# Altium schematic sheet MCU IO.SchDoc: MCU
size A4; Date: 30 08 2013; Author: Rachid AKKOUCHE; CompanyName: MDI; DrawnBy: Rachid AKKOUCHE; Engineer: Rachid AKKOUCHE; Organization: RASoftware; Address1: 52 J03, rue de la crèche; Address3: 77100 MEAUX; Address4: FRANCE; DocumentNumber: BRA2013090103C2; Revision: C; SheetNumber: 2; SheetTotal: 4; Telephone: +33651604047; Email: rachid.akkouche@wanadoo.fr; Dessinepar: -; Verifiepar: -; Property: RASoftware; Time: 13:00; ProjectName: IO BOARD CERES-V3; Application_BuildNumber: 01
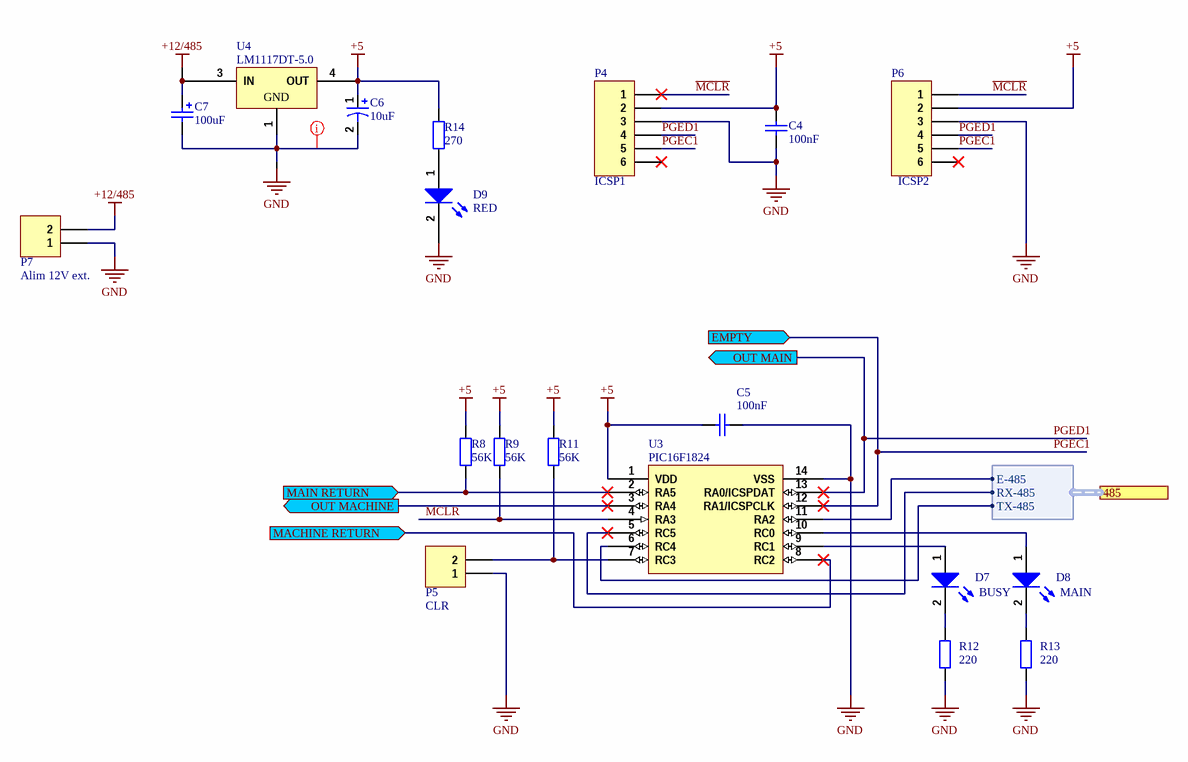
[diagram p0: MCU IO.SchDoc]

## Parts
C4  100nF  [C0805]
C5  100nF  [C0805]
C6  10uF  [KEMET_4]
C7  100uF  [Kemet_63]
D7  Indicator: BUSY  [0603-LEDR]  (hidden comment: HSMH-C190)
D8  Indicator: MAIN  [0603-LEDV]  (hidden comment: HSMH-C190)
D9  Couleur: RED  [0603-LEDR]  (hidden comment: HSMH-C190)
P4  ICSP1  [TC2030]  (no BOM)
P5  CLR  [M20_1X2]
P6  ICSP2  [6SIP100]  (no BOM)
P7  Alim 12V ext.  [CO2P508]  (no BOM)
R8  56K  [R0805]
R9  56K  [R0805]
R11  56K  [R0805]
R12  220  [R0805]
R13  220  [R0805]
R14  270  [R0805]
U3  PIC16F1824  [so-14]
U4  LM1117DT-5.0  [SOT223]

## Ports
485 (harness EIA-485), EMPTY (in), MACHINE RETURN (in), MAIN RETURN (in), OUT MACHINE (out), OUT MAIN (out)

## Harnesses
EIA-485: TX-485, RX-485, E-485

## Nets
+5: C4.2 C5.2 C6.1 P4.2 P6.2 R8.2 R9.2 R11.2 R14.2 U3.1(VDD) U4.4(OUT)
+12/485: C7.1 P7.2 U4.3(IN)
GND: C4.1 C5.1 C6.2 C7.2 D9.2(K) P4.3 P5.1 P6.3 P7.1 R12.1 R13.1 U3.14(VSS) U4.1(GND)
~{MCLR}: P4.1 P6.1 R9.1 U3.4(RA3)
MACHINE RETURN: U3.8(RC2) ; port MACHINE RETURN
MAIN RETURN: R8.1 U3.2(RA5) ; port MAIN RETURN
OUT MACHINE: U3.3(RA4) ; port OUT MACHINE
PGEC1: P4.5 P6.5 U3.12(RA1/ICSPCLK) ; port EMPTY
PGED1: P4.4 P6.4 U3.13(RA0/ICSPDAT) ; port OUT MAIN
NetD7_1: D7.1(A) U3.9(RC1)
NetD7_2: D7.2(K) R12.2
NetD8_1: D8.1(A) U3.10(RC0)
NetD8_2: D8.2(K) R13.2
NetD9_1: D9.1(A) R14.1
NetP5_2: P5.2 R11.1 U3.7(RC3)
NetU3_5: U3.5(RC5) ; port 485.RX-485
NetU3_6: U3.6(RC4) ; port 485.TX-485
NetU3_11: U3.11(RA2) ; port 485.E-485

Not connected (* = marked no-connect by the designer): P4 6*; P6 6*

## Layout directives
rule Width Constraint [Pref Width = 0.55mm    Min Width = 0.254mm    Max Width = 2mm]: GND

## Notes on the sheet
- Ce document est la propriété de
- Project:
- Il ne peut être divulgué sans l'accord écrit de l'un de ses représentants dûment mandaté
- Title:
- Number:
- Date:
- Time:
- Size:
- A4
- Revision:
- Sheet
- of
- 52 J03 rue de la crèche
- Draw by:
- 77100 Meaux

## Library data of the parts
C4 C5 = Cap 0805 100nF: Capacitor; Manufacturer: MULTICOMP; Manufacturer Part Number: MCCA000296; Supplier 1: Farnell; Supplier Part Number 1: 1759167; Pricing 1: 100=0,01, 500=0,008, 1000=0,006, 4000=0,005 (EUR); ComponentLink1URL: http://www.farnell.com/datasheets/1520827.pdf; ComponentLink1Description: http://www.farnell.com/datasheets/1520827.pdf
C6 = Cap Pol1: Polarized Capacitor; Manufacturer: KEMET; Manufacturer Part Number: EXV106M025A9BAA; Supplier 1: Farnell; Supplier Part Number 1: 2069174; RoHS: YES; Pricing 1: 10=0,111, 100=0,085, 500=0,074, 1000=0,07, 5000=0,066 (EUR); ComponentLink1URL: http://www.farnell.com/datasheets/1500293.pdf; ComponentLink1Description: http://www.farnell.com/datasheets/1500293.pdf
C7 = Cap Pol 100uF: Polarized Capacitor; Manufacturer: EPCOS; Manufacturer Part Number: B41142A4107M; Product Range: EPCOS - B41142 Series; Capacité: 100; Tolérance de capacité: ± 20%; Tension: 16; Type de boîtier de condensateur: Radial Can - SMD; Diamètre: 6.3; Résistance, ESR: 0.16; Hauteur: 7.7; Courant d'ondulation c.a.: 300; Type de packaging: Cut Tape; Durée de vie @ température: 2000 heures @ 105; Température d'utilisation min: -55; Température de fonctionnement max..: 105; SVHC: No SVHC (19-Dec-2012); Impédance: 0.26; Température de fonctionnement: -55°C à +105; Température, ESR: 20; Type de boîtier: CMS; Supplier 1: Farnell; RoHS: YES; Pricing 1: 10=0,123, 50=0,095, 100=0,078, 250=0,07, 1000=0,062 (EUR); Courant d'ondulation c.a. à  100Hz: 300; Fréquence, impédance: 100; Longueur/hauteur: 7.7; Température, courant ondulatoire: 105; Température, impédance: 20; ComponentLink1URL: http://www.epcos.com/inf/20/30/db/alu_x/B41142.pdf; ComponentLink1Description: http://www.epcos.com/inf/20/30/db/alu_x/B41142.pdf; Supplier Part Number 1: 1735328
D7-D9 = HSMH-C190: Surface Mount Chip LED, Red; Manufacturer: AVAGO TECHNOLOGIES; Manufacturer Part Number: HSMH-C190.; Taille de lampe: 0.8mm x 1; Couleur de LED: Rouge; Intensité lumineuse: 17; Angle, vision: 170°; Courant, direct, If: 20; Tension, direct à  If: 1.8; Montage LED: CMS; Forme de lentille: Rectangulaire; Longueur d'onde typ.: 626; SVHC: No SVHC (19-Dec-2012); Dissipation de puissance: 65; Intensité lumineuse min. à  If: 2.8; Intensité lumineuse typique: 10; Largeur (externe): 0.8; Longueur d'onde dominante: 639; Longueur d'onde, crête: 630; Longueur/hauteur: 1.6; Matière: AlGaAs; Nombre de broches: 2; Orientation de montage opto: Dessus; Orientation sortie de lumière: Top Emitting; Température de fonctionnement: -30°C à +85; Température de fonctionnement max..: 85; Température, stockage min.: -40; Température d'utilisation min: -30; Tension, Vf max..: 2.6; Tension, Vf min.: 2.1; Type de LED: Standard; Supplier 1: Farnell; Supplier Part Number 1: 8554641; RoHS: YES; Pricing 1: 5=0,06, 25=0,059, 100=0,057, 250=0,052, 500=0,047 (EUR); MSL: MSL 2A - 4 semaines; Couleur, LED: Rouge; Profondeur: 0.8; Température, stockage max..: 85; Tension, Vf typ.: 1.8; ComponentLink1URL: http://www.farnell.com/datasheets/313031.pdf; ComponentLink1Description: http://www.farnell.com/datasheets/313031.pdf; ComponentLink2URL: http://www.farnell.com/datasheets/55927.pdf; ComponentLink2Description: http://www.farnell.com/datasheets/55927.pdf
  D7 D8: Couleur: RED
  D9: Stock 1: 13902
P4 = Header 6: Header, 6-Pin; Manufacturer: HARWIN; Manufacturer Part Number: M20-8770642; Type de connecteur: Contact fil-à-carte; Série: M20; Terminaison du contact: Montage en surface vertical; Genre: Embase; Nombre de contacts: 6; Nombre de rangées: 1; Pas: 2.54; Plaquage du contact: Or; Matériau du contact: Laiton; SVHC: No SVHC (19-Dec-2012); Supplier 1: Farnell; Supplier Part Number 1: 1517384; RoHS: YES; Stock 1: 3471; Pricing 1: 10=0,69, 20=0,66, 50=0,62, 100=0,6, 250=0,56, 500=0,49 (EUR); Pas, rang: 2.54; ComponentLink1URL: http://www.farnell.com/datasheets/1089524.pdf; ComponentLink1Description: http://www.farnell.com/datasheets/1089524.pdf; ComponentLink2URL: http://www.farnell.com/datasheets/5481.pdf; ComponentLink2Description: http://www.farnell.com/datasheets/5481.pdf
P5 = Header 2: Header, 2-Pin; Manufacturer: HARWIN; Manufacturer Part Number: M20-8770242; LatestRevisionDate: 17-Jul-2002; LatestRevisionNote: Re-released for DXP Platform.; Publisher: Altium Limited; Supplier 1: Farnell; Supplier Part Number 1: 1895211; RoHS: YES; Pricing 1: 10=0,137, 20=0,136, 50=0,135, 100=0,133, 250=0,128, 500=0,12 (EUR); ComponentLink1URL: http://www.farnell.com/cad/1330190.pdf; ComponentLink1Description: http://www.farnell.com/cad/1330190.pdf
P6 = Header 6: Header, 6-Pin; Manufacturer: TE CONNECTIVITY / AMP; Manufacturer Part Number: 4-103321-8.; Série: AMPMODU; Pas: 2.54; Nombre de rangées: 1; Nombre de contacts: 40; Genre: Embase; Terminaison du contact: A souder; Plaquage du contact: Etain; Matériau du contact: Bronze phosphoreux; Courant: 3; Matériau isolant: Thermoplastique; Organismes d'agrément: CSA, UL; Résistance d'isolement: 500; Température de fonctionnement max..: 105; Température d'utilisation min: -65; Type de boitier: Plastique noir UL94V-0; Supplier 1: Farnell; Supplier Part Number 1: 1098454; RoHS: YES; Stock 1: 2602; Pricing 1: 1=2,12, 50=1,79, 100=1,34, 500=1,14, 1000=1,05 (EUR); Méthode de terminaison: A souder; ComponentLink1URL: http://www.tycoelectronics.com/commerce/DocumentDelivery/DDEController?Action=srchrtrv&DocNm=4-103321-8&DocType=Customer+View+Model&DocLang=English; ComponentLink1Description: http://www.tycoelectronics.com/commerce/DocumentDelivery/DDEController?Action=srchrtrv&DocNm=4-103321-8&DocType=Customer+View+Model&DocLang=English; ComponentLink2URL: http://www.farnell.com/datasheets/38278.pdf; ComponentLink2Description: http://www.farnell.com/datasheets/38278.pdf
P7 = Header 2: Header, 2-Pin
R8 R9 R11 = Resistor 0805 56K: Resistor; Manufacturer: MULTICOMP; Manufacturer Part Number: MC0.1W08051%56KFR; Product Range: MULTICOMP - MC Series; Résistance: 56; Puissance: 100; Tolérance de résistance: ± 1%; Type de boîtier de résistance: 0805; Type de résistance: Couche épaisse; Coefficient de température: ± 100; Tension: 150; Type de packaging: Full Reel; Resistor Mounting: CMS; Resistor Terminals: (Non Disponible); Supplier 1: Farnell; RoHS: YES; Pricing 1: 5000=0,001 (EUR); MSL: (Non Applicable); ComponentLink1URL: http://www.farnell.com/datasheets/1716700.pdf; ComponentLink1Description: http://www.farnell.com/datasheets/1716700.pdf; Supplier Part Number 1: 2129258
R12 R13 = Resistor 0805 220: Resistor; Manufacturer: MULTICOMP; Manufacturer Part Number: MC01W08051220R; Gamme de produit: MULTICOMP - MC Series; Puissance: 100; Tolérance de résistance: ± 1%; Type de boîtier de résistance: 0805; Type de résistance: Couche épaisse; Coefficient de température: ± 100; Tension: 150; Type de packaging: Bande et Bobine; SVHC: No SVHC (20-Jun-2013); Montage de résistance: CMS; Quantité par bobine: 5000; Supplier 1: Farnell; RoHS: YES; Stock 1: 199995; Pricing 1: 5000=0,001, 25000=0,0009, 50000=0,0008 (EUR); Résistance: 220; MSL: -; ComponentLink1URL: http://www.farnell.com/datasheets/1729047.pdf; ComponentLink1Description: http://www.farnell.com/datasheets/1729047.pdf; Supplier Part Number 1: 2129060
R14 = Resistor 0805 1K: Resistor; Manufacturer: MULTICOMP; Manufacturer Part Number: MC0.1W08051%1KFR; Product Range: MULTICOMP - MC Series; Résistance: 1; Puissance: 100; Tolérance de résistance: ± 1%; Type de boîtier de résistance: 0805; Type de résistance: Couche épaisse; Coefficient de température: ± 100; Tension: 150; Type de packaging: Full Reel; Resistor Mounting: CMS; Supplier 1: Farnell; RoHS: YES; Pricing 1: 5000=0,001 (EUR); MSL: MSL 1 - Illimité; ComponentLink1URL: http://www.farnell.com/datasheets/1716700.pdf; ComponentLink1Description: http://www.farnell.com/datasheets/1716700.pdf; Supplier Part Number 1: 2129113
U3 = PIC16(L)F1824: 14 Pin Flash Microcontrollers with XLP Technology; Manufacturer: MICROCHIP; Manufacturer Part Number: PIC16F1824-I/SL; Supplier 1: Farnell; RoHS: YES; Stock 1: 516; ComponentLink1URL: http://www.farnell.com/datasheets/1669488.pdf; ComponentLink1Description: http://www.farnell.com/datasheets/1669488.pdf; ComponentLink2URL: http://www.farnell.com/cad/1689044.zip; ComponentLink2Description: http://www.farnell.com/cad/1689044.zip; Supplier Part Number 1: 1814945
U4 = LM1117DT-5.0: 800mA Low-Dropout Linear Regulator, 3-pin TO-252; Manufacturer: TEXAS INSTRUMENTS; Manufacturer Part Number: LM1117MP-5.0; Supplier 1: Farnell; Supplier Part Number 1: 9778209; RoHS: YES; Pricing 1: 1=0,9, 10=0,86, 100=0,73 (EUR); ComponentLink1URL: http://www.farnell.com/datasheets/1685500.pdf; ComponentLink1Description: http://www.farnell.com/datasheets/1685500.pdf; ComponentLink2URL: http://www.farnell.com/cad/1562101.zip; ComponentLink2Description: http://www.farnell.com/cad/1562101.zip